# Altium schematic sheet I2C Multiplexer.SchDoc: I2C Multiplexer
size 292 x 193 mm; SheetNumber: 7; SheetTotal: 22
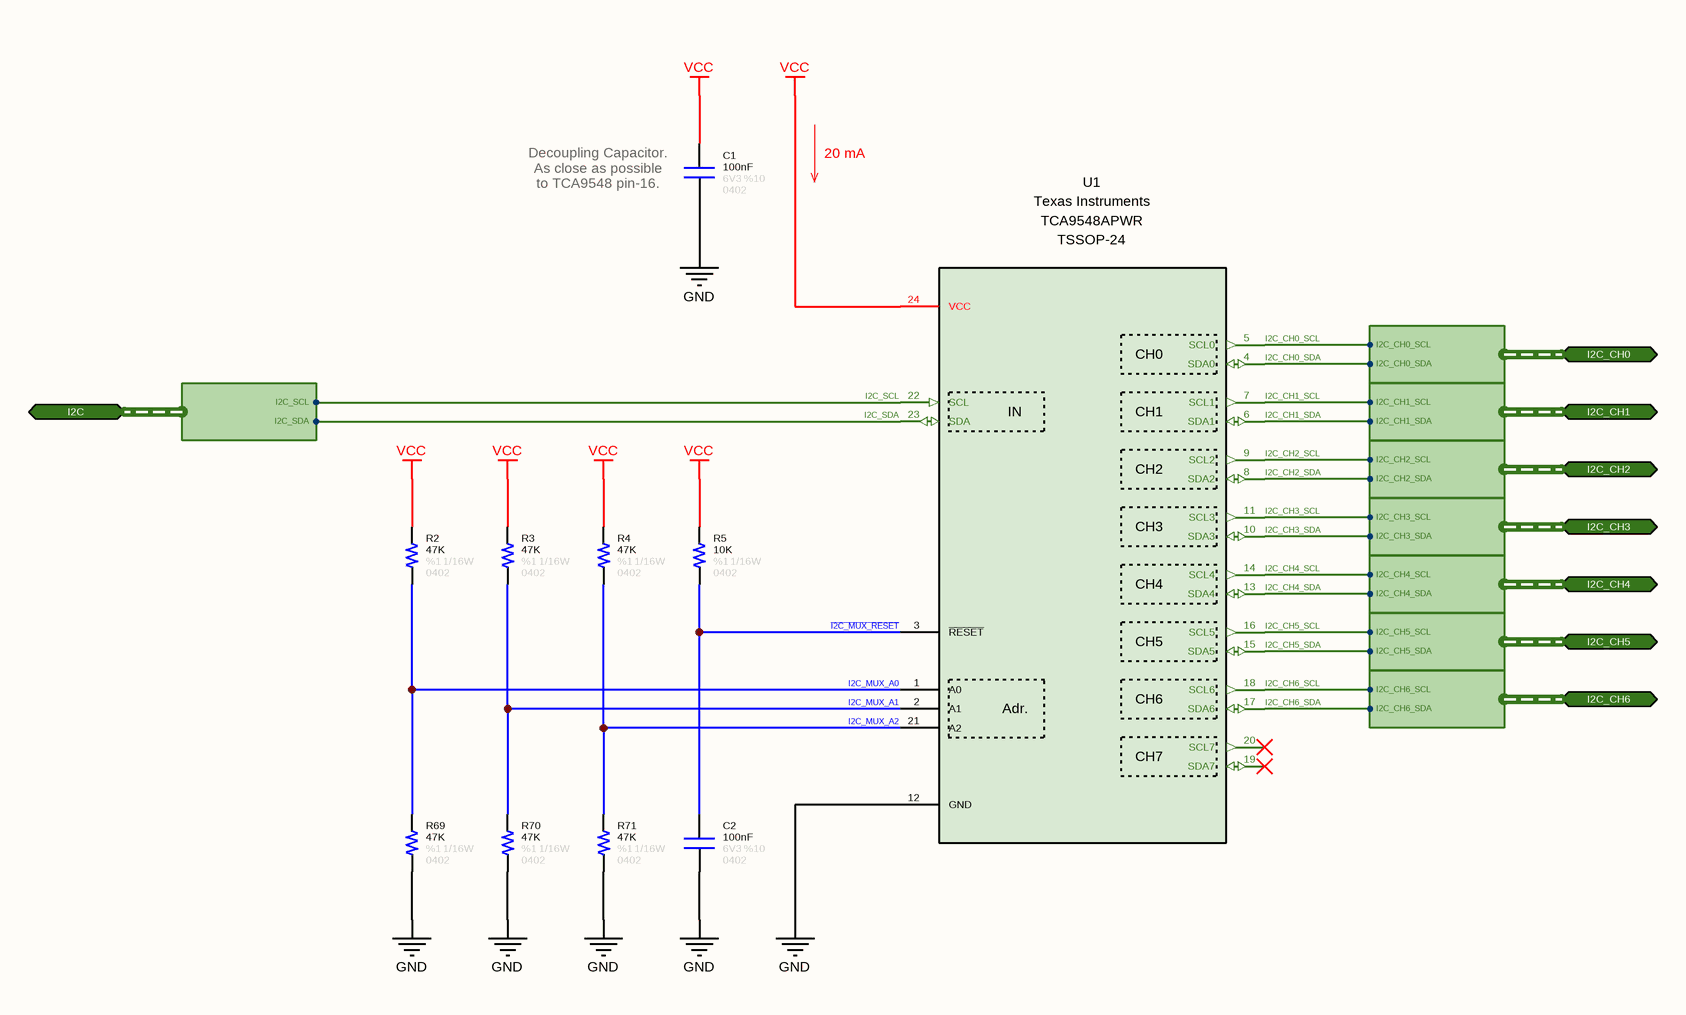
[diagram p0: I2C Multiplexer.SchDoc]

## Parts
C1  value 100nF  Tolerance: %10  Voltage: 6V3  Case: 0402  [CAPACITOR_0402]  (hidden comment: Capacitor - 100nF [0402] (Ceramic))
C2  value 100nF  Tolerance: %10  Voltage: 6V3  Case: 0402  [CAPACITOR_0402]  (hidden comment: Capacitor - 100nF [0402] (Ceramic))
R2  value 47K  Tolerance: %1  Case: 0402  Power: 1/16W  [RESISTOR_0402]  (hidden comment: 47K - 0402 - %1 - 1/16W)
R3  value 47K  Tolerance: %1  Case: 0402  Power: 1/16W  [RESISTOR_0402]  (hidden comment: 47K - 0402 - %1 - 1/16W)
R4  value 47K  Tolerance: %1  Case: 0402  Power: 1/16W  [RESISTOR_0402]  (hidden comment: 47K - 0402 - %1 - 1/16W)
R5  value 10K  Tolerance: %1  Case: 0402  Power: 1/16W  [RESISTOR_0402]  (hidden comment: 10K - 0402 - %1 - 1/16W)
R69  value 47K  Tolerance: %1  Case: 0402  Power: 1/16W  [RESISTOR_0402]  (hidden comment: 47K - 0402 - %1 - 1/16W)
R70  value 47K  Tolerance: %1  Case: 0402  Power: 1/16W  [RESISTOR_0402]  (hidden comment: 47K - 0402 - %1 - 1/16W)
R71  value 47K  Tolerance: %1  Case: 0402  Power: 1/16W  [RESISTOR_0402]  (hidden comment: 47K - 0402 - %1 - 1/16W)
U1  Manufacturer Name: Texas Instruments  [TSSOP-24]  (hidden comment: TCA9548APWR)

## Ports
I2C (bidir, harness I2C), I2C_CH0 (bidir, harness I2C_CH0), I2C_CH1 (bidir, harness I2C_CH1), I2C_CH2 (bidir, harness I2C_CH2), I2C_CH3 (bidir, harness I2C_CH3), I2C_CH4 (bidir, harness I2C_CH4), I2C_CH5 (bidir, harness I2C_CH5), I2C_CH6 (bidir, harness I2C_CH6)

## Harnesses
I2C_CH0: I2C_CH0_SCL, I2C_CH0_SDA
I2C_CH1: I2C_CH1_SCL, I2C_CH1_SDA
I2C_CH2: I2C_CH2_SCL, I2C_CH2_SDA
I2C_CH3: I2C_CH3_SCL, I2C_CH3_SDA
I2C_CH4: I2C_CH4_SCL, I2C_CH4_SDA
I2C_CH5: I2C_CH5_SCL, I2C_CH5_SDA
I2C_CH6: I2C_CH6_SCL, I2C_CH6_SDA
I2C: I2C_SDA, I2C_SCL

## Nets
GND: C1.1 C2.1 R69.1 R70.1 R71.1 U1.12(GND)
VCC: C1.2 R2.2 R3.2 R4.2 R5.2 U1.24(VCC)
I2C_CH0_SCL: U1.5(SCL0) ; port I2C_CH0.I2C_CH0_SCL
I2C_CH0_SDA: U1.4(SDA0) ; port I2C_CH0.I2C_CH0_SDA
I2C_CH1_SCL: U1.7(SCL1) ; port I2C_CH1.I2C_CH1_SCL
I2C_CH1_SDA: U1.6(SDA1) ; port I2C_CH1.I2C_CH1_SDA
I2C_CH2_SCL: U1.9(SCL2) ; port I2C_CH2.I2C_CH2_SCL
I2C_CH2_SDA: U1.8(SDA2) ; port I2C_CH2.I2C_CH2_SDA
I2C_CH3_SCL: U1.11(SCL3) ; port I2C_CH3.I2C_CH3_SCL
I2C_CH3_SDA: U1.10(SDA3) ; port I2C_CH3.I2C_CH3_SDA
I2C_CH4_SCL: U1.14(SCL4) ; port I2C_CH4.I2C_CH4_SCL
I2C_CH4_SDA: U1.13(SDA4) ; port I2C_CH4.I2C_CH4_SDA
I2C_CH5_SCL: U1.16(SCL5) ; port I2C_CH5.I2C_CH5_SCL
I2C_CH5_SDA: U1.15(SDA5) ; port I2C_CH5.I2C_CH5_SDA
I2C_CH6_SCL: U1.18(SCL6) ; port I2C_CH6.I2C_CH6_SCL
I2C_CH6_SDA: U1.17(SDA6) ; port I2C_CH6.I2C_CH6_SDA
I2C_MUX_A0: R2.1 R69.2 U1.1(A0)
I2C_MUX_A1: R3.1 R70.2 U1.2(A1)
I2C_MUX_A2: R4.1 R71.2 U1.21(A2)
I2C_SCL: U1.22(SCL) ; port I2C.I2C_SCL
I2C_SDA: U1.23(SDA) ; port I2C.I2C_SDA
~{I2C_MUX_RESET}: C2.2 R5.1 U1.3(~{RESET})

Not connected (* = marked no-connect by the designer): U1 19(SDA7)* 20(SCL7)*

## Notes on the sheet
- (near C1) Decoupling Capacitor. As close as possible to TCA9548 pin-16.
- 20 mA
- © 2021 All rights reserved.
  This document may not, in whole or in part, be copied, photocopied, reproduced, translated or converted to any electronic or machine readable from without prior written permission of Mehmet Günce Akkoyun.
  Engineer contact : akkoyun@me.com
- Property of
- Engineer :
- Date :
- Size :
- A4
- Time :
- Project :
- Page :
- /
- Customer :
- Product ID :
- Module ID :
- Version :
- File :
- Revision :
- (in symbol IC - TCA9548) CH0; IN; CH1; CH2; CH3; CH4; CH5; CH6; Adr.; CH7

## Library data of the parts
C1 C2 = Capacitor - 100nF [0402-6V3]: Capacitor - 100nF [0402-6V3] (Ceramic); Manufacturer Name: AVX; Manufacturer Part Number: 04026D104KAT4A; ComponentLink1Description: Mouser; ComponentLink1URL: https://www.mouser.com.tr/ProductDetail/AVX/04026D104KAT4A?qs=sGAEpiMZZMs0AnBnWHyRQPg4iYkCw7IMED%2F4kpqgf7w%3D; ComponentLink2Description: DataSheet; ComponentLink2URL: https://www.mouser.com.tr/datasheet/2/40/cx5r-776519.pdf
R2-R4 R69-R71 = Resistor - 47K [0402]: Thick Film Resistors - SMD 1/16 W 47 KOhm 1%; Manufacturer Name: Vishay; Manufacturer Part Number: CRCW040247K0FKED; ComponentLink1Description: DataSheet; ComponentLink1URL: https://www.mouser.com.tr/datasheet/2/427/dcrcwe3-1762152.pdf; ComponentLink2Description: Mouser; ComponentLink2URL: https://www.mouser.com.tr/ProductDetail/Vishay-Dale/CRCW040247K0FKED?qs=sGAEpiMZZMu61qfTUdNhG2DpbjADlD3GL%252B3h1elTxqU%3D
R5 = Resistor - 10K [0402]: Thick Film Resistors - SMD 1/16 W 10 KOhm 1%; Manufacturer Name: Vishay; Manufacturer Part Number: CRCW040210K0FKED; ComponentLink1Description: DataSheet; ComponentLink1URL: https://www.mouser.com.tr/datasheet/2/427/dcrcwe3-1762152.pdf; ComponentLink2Description: Mouser; ComponentLink2URL: https://www.mouser.com.tr/ProductDetail/Vishay-Dale/CRCW040210K0FKED?qs=sGAEpiMZZMu61qfTUdNhG2DpbjADlD3GcalbOv9utCY%3D
U1 = IC - TCA9548: TEXAS INSTRUMENTS - TCA9548APWR - I2C SWITCH W/ RESET, 8-CH, TSSOP-24; Supply Current - Max: 80 uA; Channel: 8; Maximum Operating Temperature: + 85 C; Minimum Operating Temperature: - 40 C; Product Type: Switch ICs; Manufacturer Part Number: TCA9548APWR; Case: TSSOP-24